# Altium project ControlBoard.PrjPcb
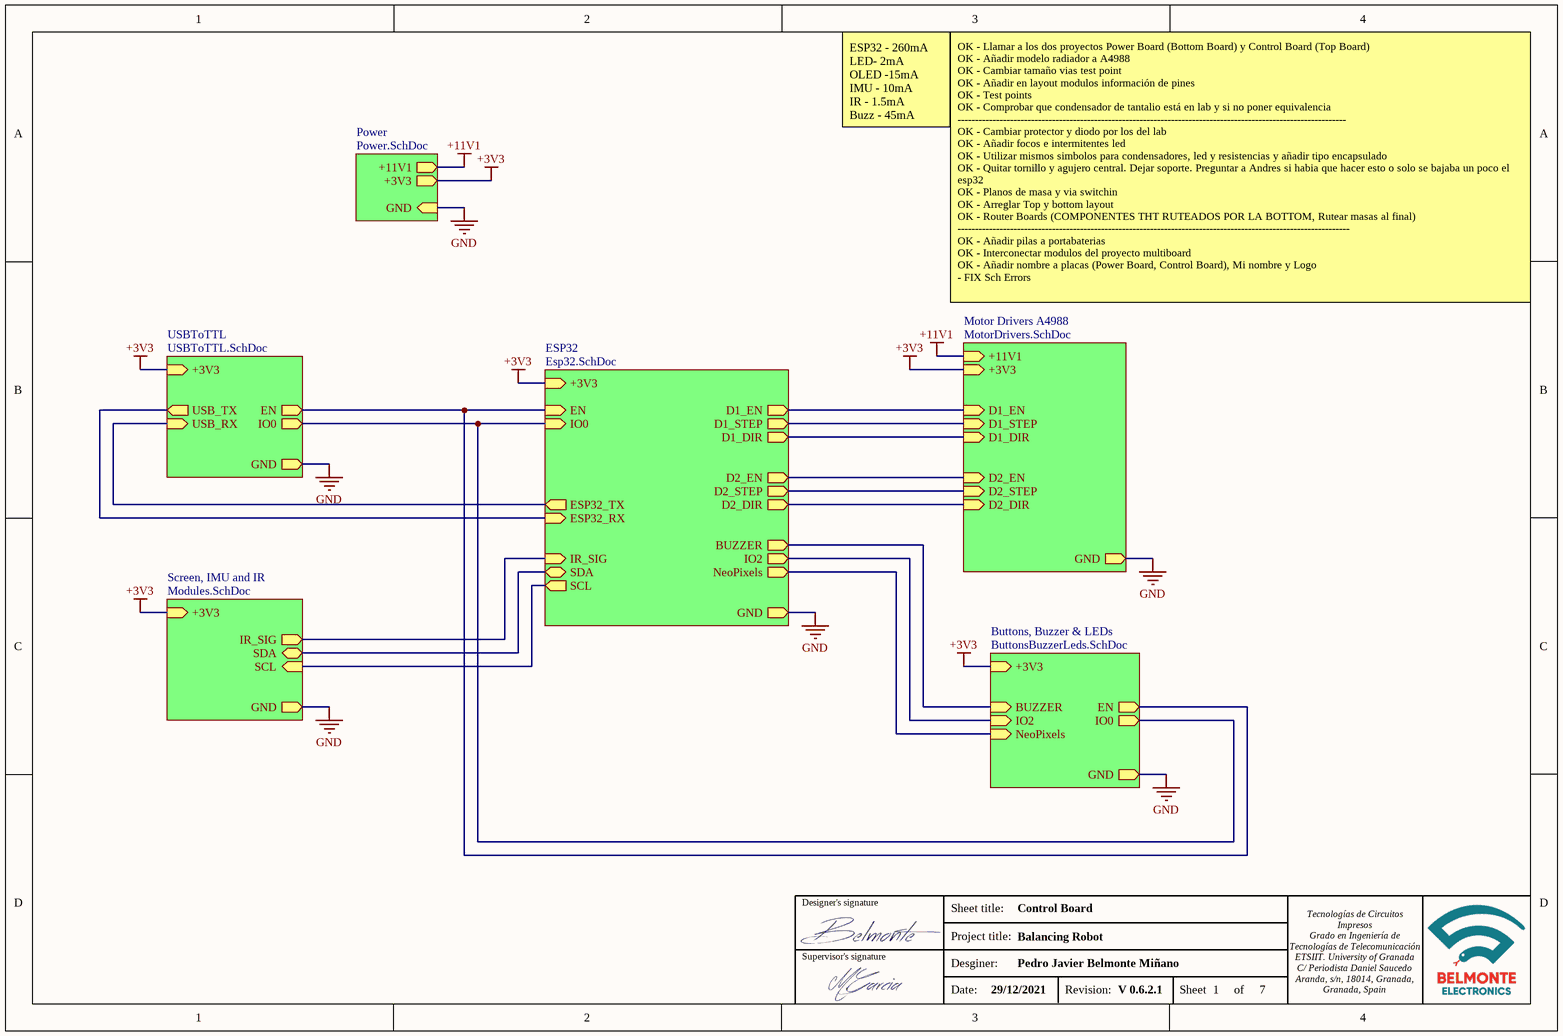
[diagram p0: ControlBoard.SchDoc]
Revision: V 0.6.2.1; ProjectTitle: Balancing Robot; Date: 29/12/2021; Author: Pedro Javier Belmonte Miñano
6 sheets, 48 parts. Net scope: hierarchical (ports join the sheet entries above them; power ports are global).
Board file: ControlBoardV6.2.PcbDoc
Sheets:
  ControlBoard.SchDoc
    ESP32 = Esp32.SchDoc
    USBToTTL = USBToTTL.SchDoc
    Motor Drivers A4988 = MotorDrivers.SchDoc
    Power = Power.SchDoc
    Buttons, Buzzer & LEDs = ButtonsBuzzerLeds.SchDoc

## Sheet ControlBoard.SchDoc: Control Board
size A4; SheetNumber: 1; SheetTotal: 7

### Sub-sheets
Buttons, Buzzer & LEDs = ButtonsBuzzerLeds.SchDoc: BUZZER (in), +3V3 (in), EN (out), IO2 (in), NeoPixels (in), IO0 (out), GND (out)
ESP32 = Esp32.SchDoc: +3V3 (in), GND (out), EN (in), D2_DIR (out), D2_EN (out), D1_STEP (out), SDA (bidir), D1_DIR (out), D1_EN (out), D2_STEP (out), IO0 (in), ESP32_RX (in), IR_SIG (in), SCL (out), ESP32_TX (out), BUZZER (out), IO2 (out), NeoPixels (out)
Motor Drivers A4988 = MotorDrivers.SchDoc: D1_EN (in), D2_EN (in), D2_STEP (in), +3V3 (in), D1_DIR (in), D2_DIR (in), GND (out), +11V1 (in), D1_STEP (in)
Power = Power.SchDoc: +11V1 (out), +3V3 (out), GND (in)
Screen, IMU and IR = Modules.SchDoc (file not in this document): GND (out), +3V3 (in), IR_SIG (out), SDA (bidir), SCL (in)
USBToTTL = USBToTTL.SchDoc: EN (out), GND (out), USB_RX (in), USB_TX (out), IO0 (out), +3V3 (in)

### Nets
+3V3: sheet ESP32/+3V3, sheet USBToTTL/+3V3, sheet Motor Drivers A4988/+3V3, sheet Power/+3V3, sheet Screen, IMU and IR/+3V3, sheet Buttons, Buzzer & LEDs/+3V3
+11V1: sheet Motor Drivers A4988/+11V1, sheet Power/+11V1
GND: sheet ESP32/GND, sheet USBToTTL/GND, sheet Motor Drivers A4988/GND, sheet Power/GND, sheet Screen, IMU and IR/GND, sheet Buttons, Buzzer & LEDs/GND
BUZZER: sheet ESP32/BUZZER, sheet Buttons, Buzzer & LEDs/BUZZER
D1_DIR: sheet ESP32/D1_DIR, sheet Motor Drivers A4988/D1_DIR
D1_EN: sheet ESP32/D1_EN, sheet Motor Drivers A4988/D1_EN
D1_STEP: sheet ESP32/D1_STEP, sheet Motor Drivers A4988/D1_STEP
D2_DIR: sheet ESP32/D2_DIR, sheet Motor Drivers A4988/D2_DIR
D2_EN: sheet ESP32/D2_EN, sheet Motor Drivers A4988/D2_EN
D2_STEP: sheet ESP32/D2_STEP, sheet Motor Drivers A4988/D2_STEP
EN: sheet ESP32/EN, sheet USBToTTL/EN, sheet Buttons, Buzzer & LEDs/EN
ESP32_RX: sheet ESP32/ESP32_RX, sheet USBToTTL/USB_TX
ESP32_TX: sheet ESP32/ESP32_TX, sheet USBToTTL/USB_RX
IO0: sheet ESP32/IO0, sheet USBToTTL/IO0, sheet Buttons, Buzzer & LEDs/IO0
IO2: sheet ESP32/IO2, sheet Buttons, Buzzer & LEDs/IO2
IR_SIG: sheet ESP32/IR_SIG, sheet Screen, IMU and IR/IR_SIG
NeoPixels: sheet ESP32/NeoPixels, sheet Buttons, Buzzer & LEDs/NeoPixels
SCL: sheet ESP32/SCL, sheet Screen, IMU and IR/SCL
SDA: sheet ESP32/SDA, sheet Screen, IMU and IR/SDA

### Notes on the sheet
- ESP32 - 260mA
  LED- 2mA
  OLED -15mA
  IMU - 10mA
  IR - 1.5mA
  Buzz - 45mA
- OK - Llamar a los dos proyectos Power Board (Bottom Board) y Control Board (Top Board)
  OK - Añadir modelo radiador a A4988
  OK - Cambiar tamaño vias test point
  OK - Añadir en layout modulos información de pines
  OK - Test points
  OK - Comprobar que condensador de tantalio está en lab y si no poner equivalencia
  ---------------------------------------------------------------------------------------------------------------
  OK - Cambiar protector y diodo por los del lab
  OK - Añadir focos e intermitentes led
  OK - Utilizar mismos simbolos para condensadores, led y resistencias y añadir tipo encapsulado
  OK - Quitar tornillo y agujero central. Dejar soporte. Preguntar a Andres si habia que hacer esto o solo se bajaba un poco el esp32
  OK - Planos de masa y via switchin
  OK - Arreglar Top y bottom layout
  OK - Router Boards (COMPONENTES THT RUTEADOS POR LA BOTTOM, Rutear masas al final)
  ----------------------------------------------------------------------------------------------------------------
  OK - Añadir pilas a portabaterias
  OK - Interconectar modulos del proyecto multiboard
  OK - Añadir nombre a placas (Power Board, Control Board), Mi nombre y Logo
  - FIX Sch Errors
- Designer's signature
- Sheet title:
- Supervisor's signature
- Project title:
- Desginer:
- Date:
- Revision:
- Sheet
- of
- Tecnologías de Circuitos Impresos
  Grado en Ingeniería de Tecnologías de Telecomunicación
  ETSIIT. University of Granada
  C/ Periodista Daniel Saucedo Aranda, s/n, 18014, Granada, Granada, Spain

## Sheet Esp32.SchDoc: ESP 32
size A4; SheetNumber: 2; SheetTotal: 7
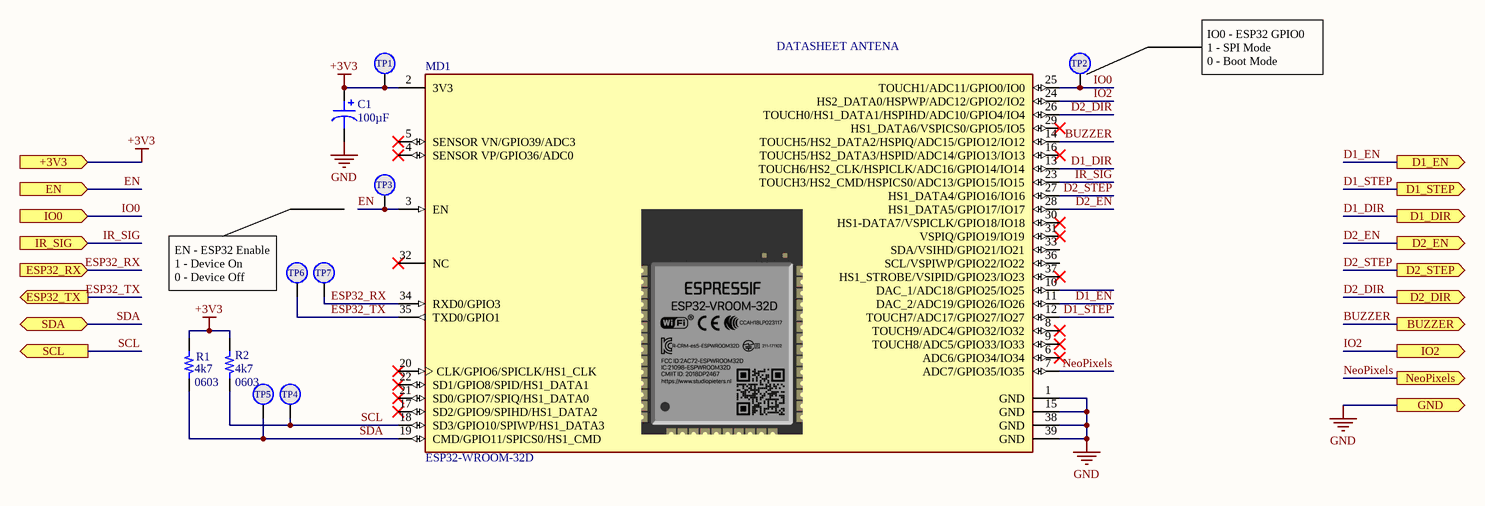
[diagram p1: Esp32.SchDoc]

### Parts
C1  Capacitance: 100µF  [CAP ALSMD POLY 5.3MM H6.1MM]  (hidden comment: ALUM 100uF)
MD1  ESP32-WROOM-32D  [FP-ESP32-WROOM-32D-MFG]
R1  4k7  Size: 0603  [RESC1608X55X30NL15T15]
R2  4k7  Size: 0603  [RESC1608X55X30NL15T15]
TP1  Test point  [TestPoint]  (value not drawn)  (no BOM)
TP2  Test point  [TestPoint]  (value not drawn)  (no BOM)
TP3  Test point  [TestPoint]  (value not drawn)  (no BOM)
TP4  Test point  [TestPoint]  (value not drawn)  (no BOM)
TP5  Test point  [TestPoint]  (value not drawn)  (no BOM)
TP6  Test point  [TestPoint]  (value not drawn)  (no BOM)
TP7  Test point  [TestPoint]  (value not drawn)  (no BOM)

### Ports
+3V3 (in), BUZZER (out), D1_DIR (out), D1_EN (out), D1_STEP (out), D2_DIR (out), D2_EN (out), D2_STEP (out), EN (in), ESP32_RX (in), ESP32_TX (out), GND (out), IO0 (in), IO2 (out), IR_SIG (in), NeoPixels (out), SCL (out), SDA (bidir)

### Nets
+3V3: C1.1 MD1.2(3V3) R1.1 R2.1 TP1.1 ; port +3V3
GND: C1.2 MD1.1(GND) MD1.15(GND) MD1.38(GND) MD1.39(GND) ; port GND
BUZZER: MD1.14(TOUCH5/HS2_DATA2/HSPIQ/ADC15/GPIO12/IO12) ; port BUZZER
D1_DIR: MD1.13(TOUCH6/HS2_CLK/HSPICLK/ADC16/GPIO14/IO14) ; port D1_DIR
D1_EN: MD1.11(DAC_2/ADC19/GPIO26/IO26) ; port D1_EN
D1_STEP: MD1.12(TOUCH7/ADC17/GPIO27/IO27) ; port D1_STEP
D2_DIR: MD1.26(TOUCH0/HS1_DATA1/HSPIHD/ADC10/GPIO4/IO4) ; port D2_DIR
D2_EN: MD1.28(HS1_DATA5/GPIO17/IO17) ; port D2_EN
D2_STEP: MD1.27(HS1_DATA4/GPIO16/IO16) ; port D2_STEP
EN: MD1.3(EN) TP3.1 ; port EN
ESP32_RX: MD1.34(RXD0/GPIO3) TP7.1 ; port ESP32_RX
ESP32_TX: MD1.35(TXD0/GPIO1) TP6.1 ; port ESP32_TX
IO0: MD1.25(TOUCH1/ADC11/GPIO0/IO0) TP2.1 ; port IO0
IO2: MD1.24(HS2_DATA0/HSPWP/ADC12/GPIO2/IO2) ; port IO2
IR_SIG: MD1.23(TOUCH3/HS2_CMD/HSPICS0/ADC13/GPIO15/IO15) ; port IR_SIG
NeoPixels: MD1.7(ADC7/GPIO35/IO35) ; port NeoPixels
SCL: MD1.18(SD3/GPIO10/SPIWP/HS1_DATA3) R2.2 TP4.1 ; port SCL
SDA: MD1.19(CMD/GPIO11/SPICS0/HS1_CMD) R1.2 TP5.1 ; port SDA

Not connected (* = marked no-connect by the designer): MD1 4(SENSOR_VP/GPIO36/ADC0)* 5(SENSOR_VN/GPIO39/ADC3)* 6(ADC6/GPIO34/IO34)* 8(TOUCH9/ADC4/GPIO32/IO32)* 9(TOUCH8/ADC5/GPIO33/IO33)* 10(DAC_1/ADC18/GPIO25/IO25) 16(TOUCH5/HS2_DATA3/HSPID/ADC14/GPIO13/IO13)* 17(SD2/GPIO9/SPIHD/HS1_DATA2)* 20(CLK/GPIO6/SPICLK/HS1_CLK)* 21(SD0/GPIO7/SPIQ/HS1_DATA0)* 22(SD1/GPIO8/SPID/HS1_DATA1)* 29(HS1_DATA6/VSPICS0/GPIO5/IO5)* 30(HS1-DATA7/VSPICLK/GPIO18/IO18)* 31(VSPIQ/GPIO19/IO19)* 32(NC)* 33(SDA/VSIHD/GPIO21/IO21) 36(SCL/VSPIWP/GPIO22/IO22) 37(HS1_STROBE/VSIPID/GPIO23/IO23)*

### Notes on the sheet
- (near MD1) DATASHEET ANTENA
- IO0 - ESP32 GPIO0
  1 - SPI Mode
  0 - Boot Mode
- (near TP6) EN - ESP32 Enable
  1 - Device On
  0 - Device Off
- Designer's signature
- Sheet title:
- Supervisor's signature
- Project title:
- Desginer:
- Date:
- Revision:
- Sheet
- of
- Tecnologías de Circuitos Impresos
  Grado en Ingeniería de Tecnologías de Telecomunicación
  ETSIIT. University of Granada
  C/ Periodista Daniel Saucedo Aranda, s/n, 18014, Granada, Granada, Spain

### Library data of the parts
C1 = MAL218497352E3: CAP ALUM 100UF 4V 2000H; Manufacturer: Vishay Beyschlag/Draloric/BC Components; ESR (Equivalent Series Resistance): 25mOhm; Lifetime @ Temp.: 2000 Hrs @ 105°C; Ripple Current @ High Frequency: 2.31A @ 100kHz; Ripple Current @ Low Frequency: 115.5mA @ 120Hz; Surface Mount Land Size: 0.209" L x 0.209" W (5.30mm x 5.30mm); Tolerance: ±20%; Type: Polymer; Value: 100µF; Part Number: MAL218497352E3; Applications: General Purpose; ComponentLink2Description: DigiKey Link; ComponentLink2URL: http://digikey.com/product-detail/en/vishay-beyschlag-draloric-bc-components/MAL218497352E3/56-MAL218497352E3-ND/12814066; Device Package: Radial, Can - SMD; Height - Seated (Max): 0.240" (6.10mm); LastUpdated: 08/30/2020 21:02:23; Lifecycle Status: Active; Minimum Order: 5000; Mounting Type: Surface Mount; Packaging: Box; PartId: 2781; Price: 0.27; Series: 184 CPNS; Size / Dimension: 0.197" Dia (5.00mm); Supplier 1: DigiKey; Supplier Part Number 1: 56-MAL218497352E3-ND
MD1 = CMP-194065-000003-1: WIFI MODULE 32MBITS SPI FLASH; Manufacturer: Espressif Systems; Max Supply Voltage: 3.6V; Nominal Supply Current: 500mA; Max Frequency: 2484MHz; Number Of Adc Channels: 16; Number Of Gpio: 32; Interface: I2C,SPI,UART,Ethernet,I2S,Other; Data Rate: 150Mbits/s; Min Supply Voltage: 3V; Bandwidth: 72MHz; Sensitivity: -98dBm; Octopart: https://octopart.com/esp32-wroom-32d-espressif+systems-91040050; Package: ESP32-WROOM-32D; ComponentLink2URL: https://www.espressif.com/sites/default/files/documentation/esp32-wroom-32d_esp32-wroom-32u_datasheet_en.pdf; Lead Free: Yes; Category: UNK; Mouser Description: Wi-Fi/BT BLE Module ESP32-D0WD, SPI Flash, UART, P; Device Class L1: Integrated Circuits (ICs); RoHS: TRUE; Temperature Range Low: -40°C; ComponentLink2Description: Datasheet; Digikey Description: WIFI MODULE 32MBITS SPI FLASH; Height: 3.2mm; Temperature: -40°C to +85°C; Manufacturer Part Number: ESP32-WROOM-32D; Device Class L3: Transceivers; Device Class L2: RF Semiconductors and Devices; Temperature Range High: +85°C; Automotive: No
R1 R2 = CMP-1012-00586-3: Precision Thick Film Chip Resistor, 4.7 KOhm, +/- 1%, -55 to 155 degC, 0603 (1608 Metric), RoHS, Tape and Reel; Manufacturer: Panasonic; Manufacturer Part Number: ERJ-3EKF4701V; Manufacturer: Vishay Dale; Manufacturer Part Number: CRCW06034K70FKTB; Manufacturer: Bourns; Manufacturer Part Number: CR0603-FX-4701ELF; Manufacturer: Yageo; Manufacturer Part Number: RC0603FR-074K7L; Manufacturer Part Number: CRCW06034K70FKTC; Manufacturer Part Number: CRCW06034K70FKEC; Manufacturer: Vishay; Manufacturer Part Number: CRCW06034K70FKEA; Manufacturer Part Number: CRCW06034K70FKTA; Manufacturer Part Number: CRCW06034K70FKEB; Voltage Rating: 50 V; Elements: 4; Case\Package: 1205; Tolerance: 5%; Power Rating: 250 mW; Max Operating Temperature: 125 degC; REACH SVHC: No SVHC; Width: 0.063 inch; Length: 0.126 inch; Mount: Surface Mount; Package Quantity: 1; DatasheetVersion: Apr-15; ComponentLink1Description: Manufacturer URL; Min Operating Temperature: -55 degC; Packaging: Tape and Reel; Radiation Hardening: No; ComponentLink2URL: http://industrial.panasonic.com/cdbs/www-data/pdf/RDA0000/AOA0000C86.pdf; Case Code (Metric): 3216; Pins: 8; Case Code (Imperial): 1206; Type (Resistor): Thick Film; RoHSCompliant: true; ComponentLink2Description: Datasheet; PackageDescription: 2-Pin Surface Mount Device, Body 1.6 x 0.85 mm; ComponentLink1URL: http://www.panasonic.com/; Height: 0.024 inch; Resistance: 4k7
TP1-TP7 = TestPoint

## Sheet USBToTTL.SchDoc: USB To TTL
size A4; SheetNumber: 3; SheetTotal: 7
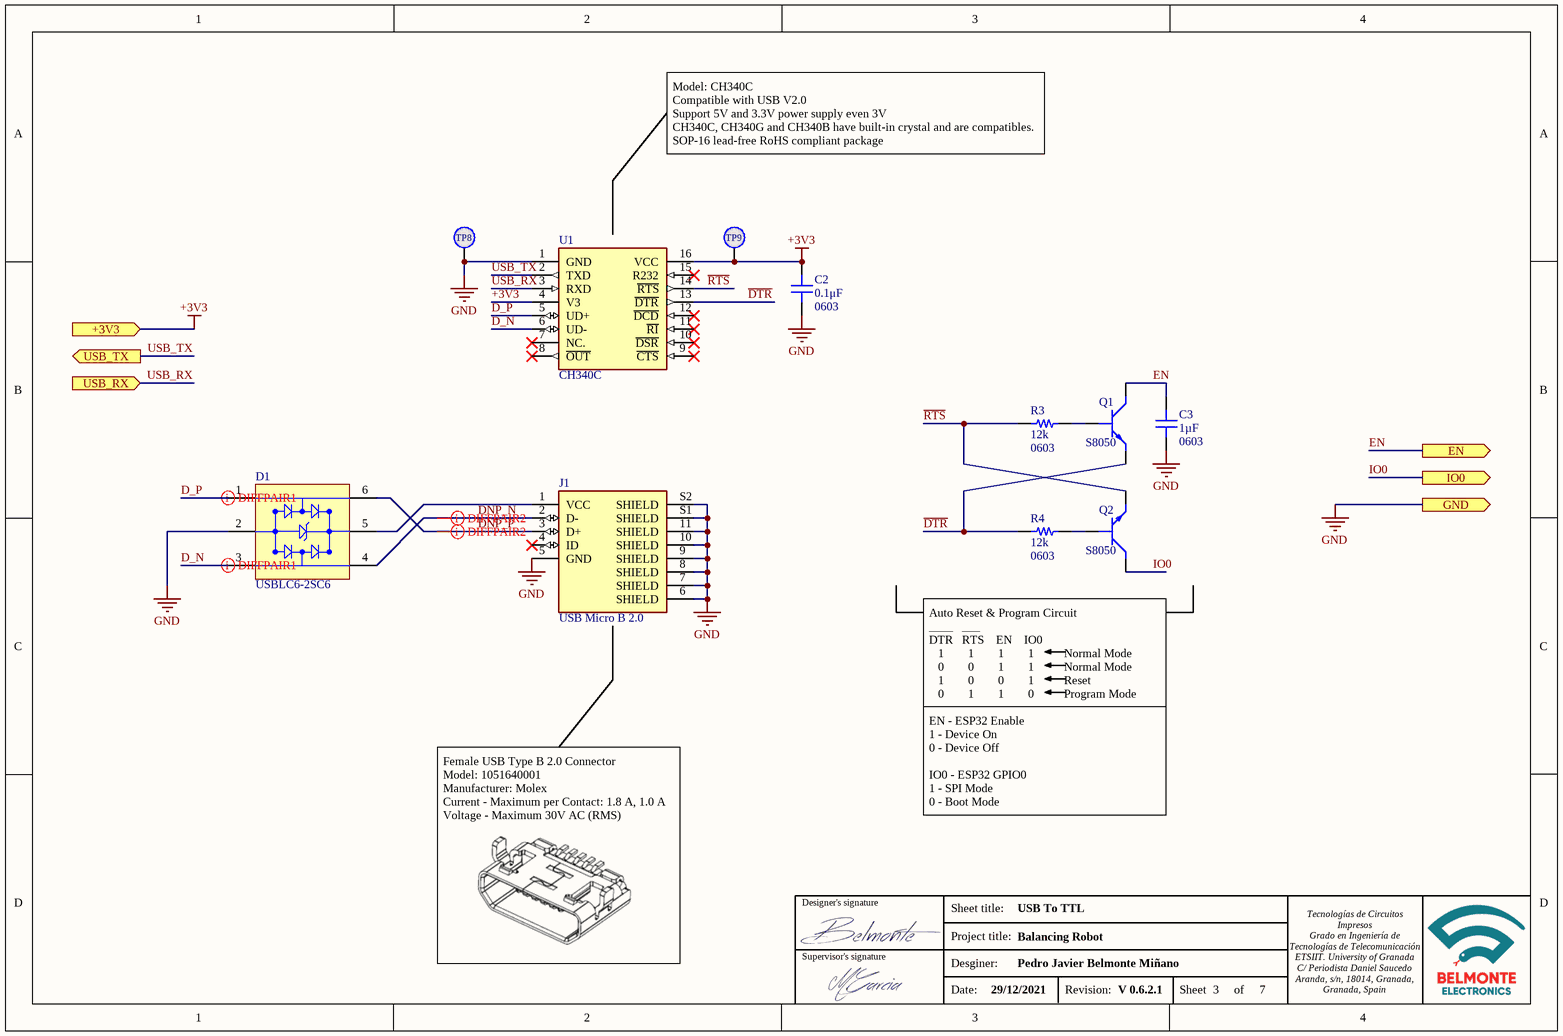
[diagram p2: USBToTTL.SchDoc]

### Parts
C2  0.1μF  Package: 0603  [FP-C0603C-CF-MFG]
C3  1µF  Size: 0603  [CAP 0603_1608]
D1  USBLC6-2SC6  [STM-SOT23-6L_V]
J1  USB Micro B 2.0  [AMPHENOL_10103594-0001LF]
Q1  S8050  [SOT95P240X115-3N]
Q2  S8050  [SOT95P240X115-3N]
R3  12k  Size: 0603  [RES 0603_1608]
R4  12k  Size: 0603  [RES 0603_1608]
TP8  Test point  [TestPoint]  (value not drawn)  (no BOM)
TP9  Test point  [TestPoint]  (value not drawn)  (no BOM)
U1  CH340C  [SOIC127P600X180-16N]

### Ports
+3V3 (in), EN (out), GND (out), IO0 (out), USB_RX (in), USB_TX (out)

### Nets
+3V3: C2.2 TP9.1 U1.4(V3) U1.16(VCC) ; port +3V3
GND: C2.1 C3.2 D1.2(GND) J1.5(GND) J1.6(SHIELD) J1.7(SHIELD) J1.8(SHIELD) J1.9(SHIELD) J1.10(SHIELD) J1.11(SHIELD) J1.S1(SHIELD) J1.S2(SHIELD) TP8.1 U1.1(GND) ; port GND
~{DTR}: Q1.3(E) R4.1 U1.13(~{DTR})
D_N: D1.3(I/O_2) U1.6(UD-)
D_P: D1.1(I/O_1) U1.5(UD+)
DNP_N: D1.4(I/O_3) J1.2(D-)
DNP_P: D1.6(I/O_4) J1.3(D+)
EN: C3.1 Q1.2(C) ; port EN
IO0: Q2.2(C) ; port IO0
~{RTS}: Q2.3(E) R3.1 U1.14(~{RTS})
USB_RX: U1.3(RXD) ; port USB_RX  [project net ESP32_TX]
USB_TX: U1.2(TXD) ; port USB_TX  [project net ESP32_RX]
NetD1_5: D1.5(VBUS) J1.1(VCC)
NetQ1_1: Q1.1(B) R3.2
NetQ2_1: Q2.1(B) R4.2

Not connected (* = marked no-connect by the designer): J1 4(ID)*; U1 7(NC.)* 8(~{OUT})* 9(~{CTS})* 10(~{DSR})* 11(~{RI})* 12(~{DCD})* 15(R232)*

### Layout directives
differential pair: D_N, D_P, DNP_N, DNP_P

### Notes on the sheet
- Model: CH340C
  Compatible with USB V2.0
  Support 5V and 3.3V power supply even 3V
  CH340C, CH340G and CH340B have built-in crystal and are compatibles.
  SOP-16 lead-free RoHS compliant package
- (near Q2) Auto Reset & Program Circuit
  ____   ___
  DTR   RTS    EN    IO0
  1        1        1        1	         Normal Mode
  0        0        1        1          Normal Mode
  1        0        0        1          Reset
  0        1        1        0          Program Mode
- EN - ESP32 Enable
  1 - Device On
  0 - Device Off
  IO0 - ESP32 GPIO0
  1 - SPI Mode
  0 - Boot Mode
- Female USB Type B 2.0 Connector
  Model: 1051640001
  Manufacturer: Molex
  Current - Maximum per Contact: 1.8 A, 1.0 A
  Voltage - Maximum 30V AC (RMS)
- Designer's signature
- Sheet title:
- Supervisor's signature
- Project title:
- Desginer:
- Date:
- Revision:
- Sheet
- of
- Tecnologías de Circuitos Impresos
  Grado en Ingeniería de Tecnologías de Telecomunicación
  ETSIIT. University of Granada
  C/ Periodista Daniel Saucedo Aranda, s/n, 18014, Granada, Granada, Spain

### Library data of the parts
C2 = CMP-2006-03061-2: CAP CER 0.1UF 50V X7R 0603; Manufacturer: KEMET; Manufacturer Part Number: C0603C104K5RACTU; Tolerance: 0.1; Temperature Coefficient: 30ppm/°C; Material: Ceramic; Automotive Grade: Grade 1; Capacitance: 0.10 μF; Temperature: -55°C to +125°C; RoHS: TRUE; Temperature Range High: +125°C; Lead Free: Yes; Octopart: https://octopart.com/c0603c104k5ractu-kemet-139244; Digikey Description: CAP CER 0.1UF 50V X7R 0603; Category: Cap; ComponentLink2Description: Datasheet; Temperature Range Low: -55°C; Device Class L1: Passive Components; Voltage Rating: 50 V; Automotive: Yes; Device Class L3: Ceramic Capacitors; ComponentLink2URL: https://api.kemet.com/component-edge/download/datasheet/C0603C100J5GACAUTO.pdf; Device Class L2: Capacitors; Temperature Characteristic: X7R; Height: 0.87mm
C3 = C0603C105K4RACAUTO: CAP CER 0603 1UF 16V X7R 10%; Manufacturer: KEMET; Part Number: C0603C105K4RACAUTO; Applications: Automotive, Bypass, Decoupling; Capacitance: 1µF; ComponentLink1Description: Datasheet; ComponentLink1URL: https://api.kemet.com/component-edge/download/datasheet/C0603C105K4RACAUTO.pdf; ComponentLink2Description: DigiKey Link; ComponentLink2URL: http://digikey.com/product-detail/en/kemet/C0603C105K4RACAUTO/399-17704-1-ND/8635855; Device Package: 0603 (1608 Metric); LastUpdated: 09/02/2020 01:03:36; Lifecycle Status: Active; Minimum Order: 1; Mounting Type: Surface Mount, MLCC; Operating Temperature: -55°C ~ 125°C; Package / Case: 0603 (1608 Metric); Packaging: TapeAndReel; PartId: 2179; Part Status: Active; Price: 0.02; Ratings: AEC-Q200; Series: SMD Auto X7R; Size / Dimension: 0.063" L x 0.031" W (1.60mm x 0.80mm); Supplier 1: DigiKey; Supplier Part Number 1: 399-17704-1-ND; Temperature Coefficient: X7R; Thickness (Max): 0.037" (0.95mm); Tolerance: ±10%; Voltage - Rated: 16V; Value: 1µF
D1 = CMP-2000-05378-1: Very low capacitance ESD protection, 3.5 pF, -40 to 125 degC, 6-Pin SOT23, RoHS, Tape and Reel; Manufacturer: STMicroelectronics; Polarity: Uni-Directional; Clamping Voltage: 17V; Rad Hardened: No; Product Height (mm): 1.3mm; Leakage Current (Max): 0.15uA; Product Length (mm): 3.05mm; Number of Elements: 1; Peak Pulse Current: 5A; Configuration: Dual; Reverse Breakdown Voltage: 6V; Working Voltage (Max): 5V; Capacitance Value: 3.5pF; Suppressor Type: DiodeArrays; Product Depth (mm): 1.75mm; Test Current (It): 1mA; Package / Case: SOT-23; Operating Temperature Max Deg. C: 125C; Package Description: 6-Pin Small Outline Transistor, Body 2.925 x 1.625 mm, Pitch 0.95 mm; Package Reference: SOT23-6L; Datasheet Version: Rev. 5, 10/2011; Operating Temperature Min Deg. C: -40C; Mounting Style: SurfaceMount; Direction Type: Uni-Directional; Mounting: SurfaceMount; Pin Count: 6; Leakage Current: 0.15uA; Packaging: TapeandReel; Operating Temperature Classification: Automotive; Clamping Voltage (Max): 17V; Manufacturer URL: http://www.st.com/; Reverse Stand-off Voltage: 5V; Datasheet URL: http://www.st.com/st-web-ui/static/active/en/resource/technical/document/datasheet/CD00050750.pdf; Working Voltage: 5V; Operating Temp Range: -40Cto125C; Manufacturer Part Number: USBLC6-2SC6
J1 = 10103594-0001LF: USB - micro B USB 2.0 Receptacle Connector 5 Position Surface Mount, Right Angle; Through Hole; MF: Amphenol ICC (FCI); Package: None; MP: 10103594-0001LF; Check_prices: https://www.snapeda.com/parts/10103594-0001LF/Amphenol%20FCI/view-part/5161044/?ref=eda; Purchase-URL: https://pricing.snapeda.com/search/part/10103594-0001LF/?ref=eda; Value: *; Availability: Good; Price: None; SnapEDA_Link: https://www.snapeda.com/parts/10103594-0001LF/Amphenol%20FCI/view-part/5161044/?ref=snap
Q1 Q2 = S8050: Transistor; Manufacturer_Name: Yenji Elec; Datasheet Link: https://datasheet.lcsc.com/szlcsc/Yenji-Elec-S8050_C139514.pdf; Height: 1.15mm; Manufacturer_Part_Number: S8050
R3 R4 = RMCF0603JT12K0: RES 12K OHM 5% 1/10W 0603; Manufacturer: Stackpole Electronics Inc; Power (Watts): 0.1W, 1/10W; Resistance: 12 kOhms; Temperature Coefficient: ±200ppm/°C; Value: 12 kOhms; Part Number: RMCF0603JT12K0; ComponentLink1Description: Datasheet; ComponentLink1URL: https://www.seielect.com/catalog/sei-rmcf_rmcp.pdf; ComponentLink2Description: DigiKey Link; ComponentLink2URL: http://digikey.com/product-detail/en/stackpole-electronics-inc/RMCF0603JT12K0/RMCF0603JT12K0CT-ND/1943192; Composition: Thick Film; Device Package: 0603 (1608 Metric); Features: Automotive AEC-Q200; Height - Seated (Max): 0.022" (0.55mm); LastUpdated: 09/02/2020 01:10:24; Lifecycle Status: Active; Minimum Order: 1; Number of Terminations: 2; Operating Temperature: -55°C ~ 155°C; Package / Case: 0603 (1608 Metric); Packaging: CutTape; PartId: 5166; Part Status: Active; Price: 0.10; Ratings: AEC-Q200; Series: RMCF; Size / Dimension: 0.061" L x 0.031" W (1.55mm x 0.80mm); Supplier 1: DigiKey; Supplier Part Number 1: RMCF0603JT12K0CT-ND; Supplier Device Package: 0603; Tolerance: ±5%
TP8 TP9 = TestPoint
U1 = CH340C: USB to serial chip CH340; MF: WCH; Package: None; Availability: Not in stock; SnapEDA_Link: https://www.snapeda.com/parts/CH340C/WCH/view-part/?ref=snap; MP: CH340C; Check_prices: https://www.snapeda.com/parts/CH340C/WCH/view-part/?ref=eda; Value: *; Price: None

## Sheet MotorDrivers.SchDoc: Motor Drivers A4988
size A4; SheetNumber: 4; SheetTotal: 7
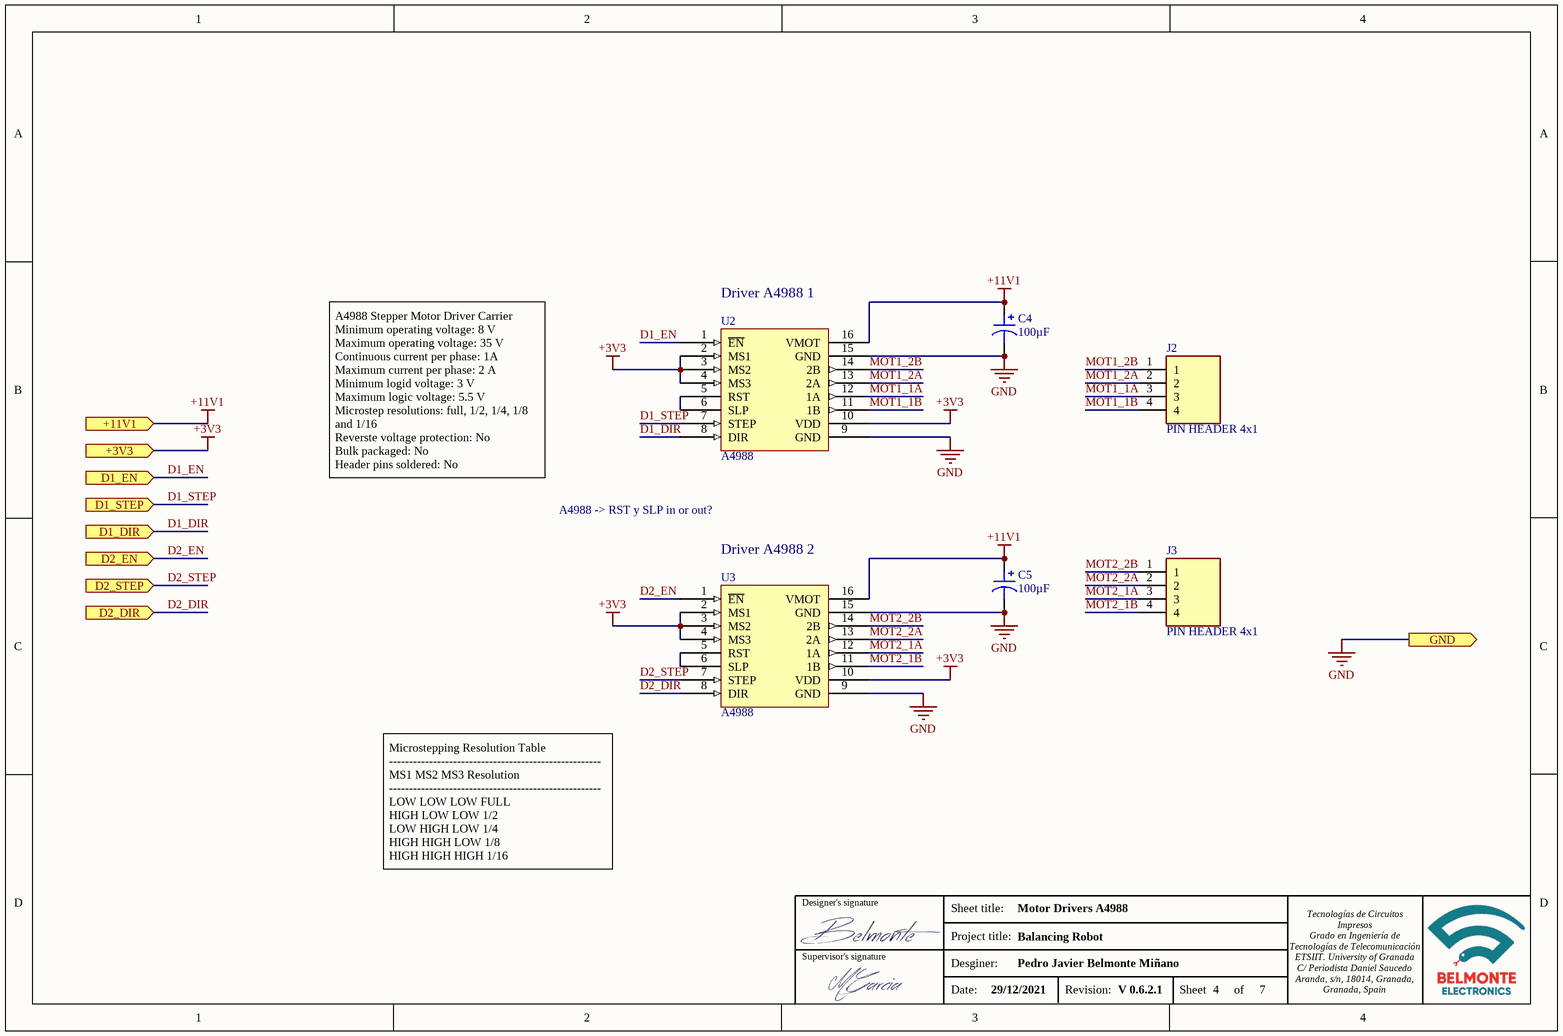
[diagram p3: MotorDrivers.SchDoc]

### Parts
C4  Capacitance: 100µF  [CAP ALSMD POLY 5.3MM H6.1MM]  (hidden comment: ALUM 100uF)
C5  Capacitance: 100µF  [CAP ALSMD POLY 5.3MM H6.1MM]  (hidden comment: ALUM 100uF)
J2  PIN HEADER 4x1  [HDRV4W50P0X200_1X4_800X200X525P]
J3  PIN HEADER 4x1  [HDRV4W50P0X200_1X4_800X200X525P]
U2  A4988  [A4988]
U3  A4988  [A4988]

### Ports
+3V3 (in), +11V1 (in), D1_DIR (in), D1_EN (in), D1_STEP (in), D2_DIR (in), D2_EN (in), D2_STEP (in), GND (out)

### Nets
+3V3: U2.2(MS1) U2.3(MS2) U2.4(MS3) U2.10(VDD) U3.2(MS1) U3.3(MS2) U3.4(MS3) U3.10(VDD) ; port +3V3
+11V1: C4.1 C5.1 U2.16(VMOT) U3.16(VMOT) ; port +11V1
GND: C4.2 C5.2 U2.9(GND) U2.15(GND) U3.9(GND) U3.15(GND) ; port GND
D1_DIR: U2.8(DIR) ; port D1_DIR
D1_EN: U2.1(~{EN}) ; port D1_EN
D1_STEP: U2.7(STEP) ; port D1_STEP
D2_DIR: U3.8(DIR) ; port D2_DIR
D2_EN: U3.1(~{EN}) ; port D2_EN
D2_STEP: U3.7(STEP) ; port D2_STEP
MOT1_1A: J2.3 U2.12(1A)
MOT1_1B: J2.4 U2.11(1B)
MOT1_2A: J2.2 U2.13(2A)
MOT1_2B: J2.1 U2.14(2B)
MOT2_1A: J3.3 U3.12(1A)
MOT2_1B: J3.4 U3.11(1B)
MOT2_2A: J3.2 U3.13(2A)
MOT2_2B: J3.1 U3.14(2B)
NetU2_5: U2.5(RST) U2.6(SLP)
NetU3_5: U3.5(RST) U3.6(SLP)

### Notes on the sheet
- (near U2) Driver A4988 1
- A4988 Stepper Motor Driver Carrier
  Minimum operating voltage: 8 V
  Maximum operating voltage: 35 V
  Continuous current per phase: 1A
  Maximum current per phase: 2 A
  Minimum logid voltage: 3 V
  Maximum logic voltage: 5.5 V
  Microstep resolutions: full, 1/2, 1/4, 1/8 and 1/16
  Reverste voltage protection: No
  Bulk packaged: No
  Header pins soldered: No
- A4988 -> RST y SLP in or out?
- (near U3) Driver A4988 2
- Microstepping Resolution Table
  -----------------------------------------------------
  MS1	MS2	MS3	Resolution
  -----------------------------------------------------
  LOW	LOW	LOW	FULL
  HIGH	LOW	LOW	1/2
  LOW	HIGH	LOW	1/4
  HIGH	HIGH	LOW	1/8
  HIGH	HIGH	HIGH	1/16
- Designer's signature
- Sheet title:
- Supervisor's signature
- Project title:
- Desginer:
- Date:
- Revision:
- Sheet
- of
- Tecnologías de Circuitos Impresos
  Grado en Ingeniería de Tecnologías de Telecomunicación
  ETSIIT. University of Granada
  C/ Periodista Daniel Saucedo Aranda, s/n, 18014, Granada, Granada, Spain

### Library data of the parts
C4 C5 = MAL218497352E3: as C1 on sheet Esp32; Part Number: MAL218497352E3; Applications: General Purpose; ComponentLink2Description: DigiKey Link; ComponentLink2URL: http://digikey.com/product-detail/en/vishay-beyschlag-draloric-bc-components/MAL218497352E3/56-MAL218497352E3-ND/12814066; Device Package: Radial, Can - SMD; Height - Seated (Max): 0.240" (6.10mm); LastUpdated: 08/30/2020 21:02:23; Lifecycle Status: Active; Minimum Order: 5000; Mounting Type: Surface Mount; Packaging: Box; PartId: 2781; Price: 0.27; Series: 184 CPNS; Size / Dimension: 0.197" Dia (5.00mm); Supplier 1: DigiKey; Supplier Part Number 1: 56-MAL218497352E3-ND
J2 J3 = M22-2510405: Connector; Manufacturer_Name: Harwin; Datasheet Link: https://cdn.harwin.com/pdfs/M22-251.pdf; Height: 5.25mm; Manufacturer_Part_Number: M22-2510405; Mouser Part Number: 855-M22-2510405; Mouser Price/Stock: https://www.mouser.co.uk/ProductDetail/Harwin/M22-2510405?qs=vF78I%252BjhbY9z7PsFZBZ5CA%3D%3D
U2 U3 = A4988: Pololu A4988 Stepper Motor Driver Carrier; ComponentLink1Description: Datasheet carrier; ComponentLink1URL: https://www.robotshop.com/media/files/pdf/datasheet-1182.pdf; ComponentLink2Description: Datasheet A4988; ComponentLink2URL: https://www.pololu.com/file/0J450/a4988_DMOS_microstepping_driver_with_translator.pdf

## Sheet Power.SchDoc: Power
size A4; SheetNumber: 5; SheetTotal: 7
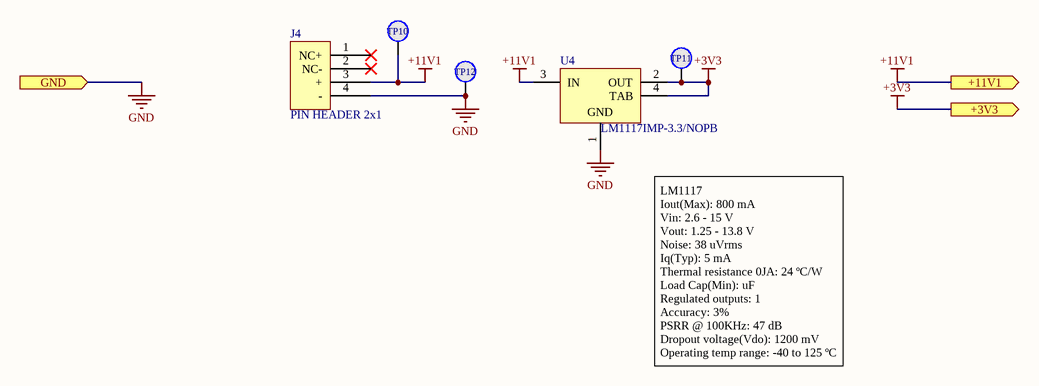
[diagram p4: Power.SchDoc]

### Parts
J4  PIN HEADER 2x1  [M20-9950245]
TP10  Test point  [TestPoint]  (value not drawn)  (no BOM)
TP11  Test point  [TestPoint]  (value not drawn)  (no BOM)
TP12  Test point  [TestPoint]  (value not drawn)  (no BOM)
U4  LM1117IMP-3.3/NOPB  [DCY0004A_N]

### Ports
+3V3 (out), +11V1 (out), GND (in)

### Nets
+3V3: TP11.1 U4.2(OUT) U4.4(TAB) ; port +3V3
+11V1: J4.3(+) TP10.1 U4.3(IN) ; port +11V1
GND: J4.4(-) TP12.1 U4.1(GND) ; port GND

Not connected (* = marked no-connect by the designer): J4 1(NC+)* 2(NC-)*

### Notes on the sheet
- LM1117
  Iout(Max): 800 mA
  Vin: 2.6 - 15 V
  Vout: 1.25 - 13.8 V
  Noise: 38 uVrms
  Iq(Typ): 5 mA
  Thermal resistance 0JA: 24 ºC/W
  Load Cap(Min): uF
  Regulated outputs: 1
  Accuracy: 3%
  PSRR @ 100KHz: 47 dB
  Dropout voltage(Vdo): 1200 mV
  Operating temp range: -40 to 125 ºC
- Designer's signature
- Sheet title:
- Supervisor's signature
- Project title:
- Desginer:
- Date:
- Revision:
- Sheet
- of
- Tecnologías de Circuitos Impresos
  Grado en Ingeniería de Tecnologías de Telecomunicación
  ETSIIT. University of Granada
  C/ Periodista Daniel Saucedo Aranda, s/n, 18014, Granada, Granada, Spain

### Library data of the parts
J4 = M20-9950245: M20-9950245 Pin Connector; ComponentLink1Description: Datasheet; ComponentLink1URL: https://www.snapeda.com/parts/M20-9950245/Harwin/datasheet/; System: Connector
TP10-TP12 = TestPoint
U4 = CMP-0062-01631-4: 800mA Low-Dropout Linear Regulator, 4-pin SOT-223, Pb-Free; Manufacturer: Texas Instruments; PackageTopMarking: XYTT*N05B; PowerWise: N; High-Reliability: Y; CompType: LDO IC; Code_IPC: SOT223-4; PackageReference: DCY0004A; PinCount: 4; PackageDescription: Molded SOT-223, 6.50 x 3.56 x 1.6mm Body, 4 Lead, 2.3mm Pitch; PartNumber: LM1117IMP-3.3/NOPB; RoHS: Y; ComponentLink1Description: Datasheet URL; Code_JEDEC: TO-261-AA; ComponentLink1URL: http://www.ti.com/general/docs/lit/getliterature.tsp?genericPartNumber=LM1117-N&fileType=pdf; Manufacturer Part Number: LM1117IMP-3.3/NOPB

## Sheet ButtonsBuzzerLeds.SchDoc: Buzzer and LEDs
size A4; SheetNumber: 7; SheetTotal: 7
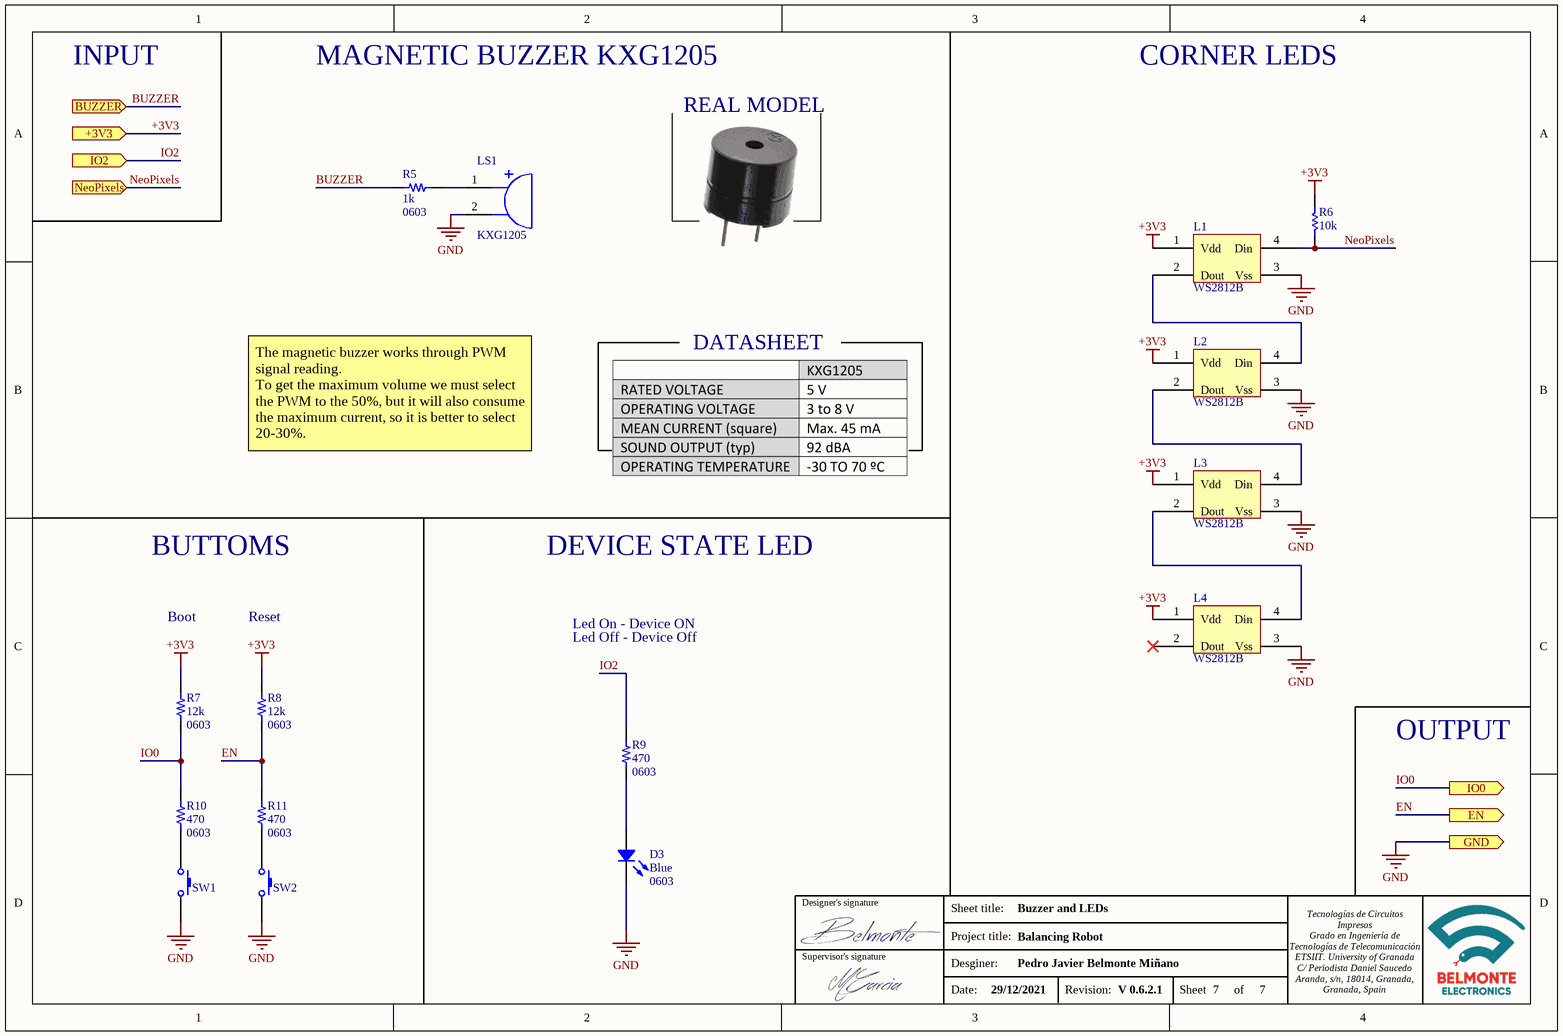
[diagram p5: ButtonsBuzzerLeds.SchDoc]

### Parts
D3  Blue  Size: 0603  [LED 0603_1608 BLUE]
L1  WS2812B  [WS2812B]
L2  WS2812B  [WS2812B]
L3  WS2812B  [WS2812B]
L4  WS2812B  [WS2812B]
LS1  KXG1205  [BUZZER]
R5  1k  Size: 0603  [RES 0603_1608]
R6  value 10k  [0805]
R7  12k  Size: 0603  [RES 0603_1608]
R8  12k  Size: 0603  [RES 0603_1608]
R9  470  Size: 0603  [RES 0603_1608]
R10  470  Size: 0603  [RES 0603_1608]
R11  470  Size: 0603  [RES 0603_1608]
SW1  FSMSMTR  [TECO-FSMSMTR_V]  (value not drawn)
SW2  FSMSMTR  [TECO-FSMSMTR_V]  (value not drawn)

### Ports
+3V3 (in), BUZZER (in), EN (out), GND (out), IO0 (out), IO2 (in), NeoPixels (in)

### Nets
+3V3: L1.1(Vdd) L2.1(Vdd) L3.1(Vdd) L4.1(Vdd) R6.1 R7.1 R8.1 ; port +3V3
GND: D3.2 L1.3(Vss) L2.3(Vss) L3.3(Vss) L4.3(Vss) LS1.2(-) SW1.2 SW2.2 ; port GND
BUZZER: R5.2 ; port BUZZER
EN: R8.2 R11.1 ; port EN
IO0: R7.2 R10.1 ; port IO0
IO2: R9.1 ; port IO2
NeoPixels: L1.4(Din) R6.2 ; port NeoPixels
NetD3_1: D3.1 R9.2
NetL1_2: L1.2(Dout) L2.4(Din)
NetL2_2: L2.2(Dout) L3.4(Din)
NetL3_2: L3.2(Dout) L4.4(Din)
NetLS1_1: LS1.1(+) R5.1
NetR10_2: R10.2 SW1.1
NetR11_2: R11.2 SW2.1

Not connected (* = marked no-connect by the designer): L4 2(Dout)*

### Notes on the sheet
- INPUT
- MAGNETIC BUZZER KXG1205
- REAL MODEL
- CORNER LEDS
- DATASHEET
- The magnetic buzzer works through PWM signal reading.
  To get the maximum volume we must select the PWM to the 50%, but it will also consume the maximum current, so it is better to select 20-30%.
- BUTTOMS
- DEVICE STATE LED
- Boot
- Reset
- Led On - Device ON
- Led Off - Device Off
- OUTPUT
- Designer's signature
- Sheet title:
- Supervisor's signature
- Project title:
- Desginer:
- Date:
- Revision:
- Sheet
- of
- Tecnologías de Circuitos Impresos
  Grado en Ingeniería de Tecnologías de Telecomunicación
  ETSIIT. University of Granada
  C/ Periodista Daniel Saucedo Aranda, s/n, 18014, Granada, Granada, Spain

### Library data of the parts
D3 = LED: LED BLUE 0603 SMD; Part Number: VLMB1300-GS08; Manufacturer: Vishay Semiconductor Opto Division; Configuration: Standard; Current - Test: 20mA; Lens Color: 1.00mm; Lens Size: 1.10mm x 0.80mm; Lens Style: Rectangle with Flat Top; Millicandela Rating: 104mcd; Viewing Angle: 130°; Voltage - Forward (Vf) (Typ): 3.3V; Wavelength - Dominant: 470nm; Wavelength - Peak: 468nm; Color: Blue; ComponentLink1Description: Datasheet; ComponentLink1URL: http://www.vishay.com/docs/82437/vlmo1300.pdf; ComponentLink2Description: DigiKey Link; ComponentLink2URL: http://digikey.com/product-detail/en/vishay-semiconductor-opto-division/VLMB1300-GS08/VLMB1300-GS08CT-ND/3025485; Device Package: 0603 (1608 Metric); Height (Max): 1.00mm; LastUpdated: 09/02/2020 01:20:26; Lifecycle Status: Active; Minimum Order: 1; Mounting Type: Surface Mount; Package / Case: 0603 (1608 Metric); Packaging: TapeAndReel; PartId: 785; Part Status: Active; Price: 0.08; Series: CHIPLED; Size / Dimension: 1.60mm L x 0.80mm W; Supplier 1: DigiKey; Supplier Part Number 1: VLMB1300-GS08CT-ND; Supplier Device Package: 0603; Value: Blue
LS1 = Buzzer
R5 = CRCW06031K00FKEAHP: RES SMD 1K OHM 1% 1/4W 0603; Manufacturer: Vishay Dale; Power (Watts): 0.25W, 1/4W; Resistance: 1 kOhms; Temperature Coefficient: ±100ppm/°C; Part Number: CRCW06031K00FKEAHP; ComponentLink1Description: Datasheet; ComponentLink1URL: http://www.vishay.com/docs/20043/crcwhpe3.pdf; ComponentLink2Description: DigiKey Link; ComponentLink2URL: http://digikey.com/product-detail/en/vishay-dale/CRCW06031K00FKEAHP/541-1.00KSCT-ND/2222766; Composition: Thick Film; Device Package: 0603 (1608 Metric); Features: Automotive AEC-Q200, Pulse Withstanding; Height - Seated (Max): 0.022" (0.55mm); LastUpdated: 09/02/2020 01:10:05; Lifecycle Status: Active; Minimum Order: 1; Number of Terminations: 2; Operating Temperature: -55°C ~ 155°C; Package / Case: 0603 (1608 Metric); Packaging: TapeAndReel; PartId: 14350; Part Status: Active; Price: 0.02; Ratings: AEC-Q200; Series: CRCW-HP; Size / Dimension: 0.063" L x 0.033" W (1.60mm x 0.85mm); Supplier 1: DigiKey; Supplier Part Number 1: 541-1.00KSCT-ND; Supplier Device Package: 0603; Tolerance: ±1%
R6 = Resistor: Supplier 1: Farnell; Supplier Part Number 1: 2358436
R7 R8 = RMCF0603JT12K0: as R3 on sheet USBToTTL; Part Number: RMCF0603JT12K0; ComponentLink1Description: Datasheet; ComponentLink1URL: https://www.seielect.com/catalog/sei-rmcf_rmcp.pdf; ComponentLink2Description: DigiKey Link; ComponentLink2URL: http://digikey.com/product-detail/en/stackpole-electronics-inc/RMCF0603JT12K0/RMCF0603JT12K0CT-ND/1943192; Composition: Thick Film; Device Package: 0603 (1608 Metric); Features: Automotive AEC-Q200; Height - Seated (Max): 0.022" (0.55mm); LastUpdated: 09/02/2020 01:10:24; Lifecycle Status: Active; Minimum Order: 1; Number of Terminations: 2; Operating Temperature: -55°C ~ 155°C; Package / Case: 0603 (1608 Metric); Packaging: CutTape; PartId: 5166; Part Status: Active; Price: 0.10; Ratings: AEC-Q200; Series: RMCF; Size / Dimension: 0.061" L x 0.031" W (1.55mm x 0.80mm); Supplier 1: DigiKey; Supplier Part Number 1: RMCF0603JT12K0CT-ND; Supplier Device Package: 0603; Tolerance: ±5%
R9-R11 = RMCF0603JT470R: RES 470 OHM 5% 1/10W 0603; Manufacturer: Stackpole Electronics Inc; Power (Watts): 0.1W, 1/10W; Resistance: 470 Ohms; Temperature Coefficient: ±200ppm/°C; Value: 470 Ohms; Part Number: RMCF0603JT470R; ComponentLink1Description: Datasheet; ComponentLink1URL: https://www.seielect.com/catalog/sei-rmcf_rmcp.pdf; ComponentLink2Description: DigiKey Link; ComponentLink2URL: http://digikey.com/product-detail/en/stackpole-electronics-inc/RMCF0603JT470R/RMCF0603JT470RCT-ND/1943166; Composition: Thick Film; Device Package: 0603 (1608 Metric); Features: Automotive AEC-Q200; Height - Seated (Max): 0.022" (0.55mm); LastUpdated: 09/02/2020 01:10:23; Lifecycle Status: Active; Minimum Order: 1; Number of Terminations: 2; Operating Temperature: -55°C ~ 155°C; Package / Case: 0603 (1608 Metric); Packaging: CutTape; PartId: 5857; Part Status: Active; Price: 0.10; Ratings: AEC-Q200; Series: RMCF; Size / Dimension: 0.061" L x 0.031" W (1.55mm x 0.80mm); Supplier 1: DigiKey; Supplier Part Number 1: RMCF0603JT470RCT-ND; Supplier Device Package: 0603; Tolerance: ±5%
SW1 SW2 = CMP-2000-07501-1: FSMSM Push Button Switch, 50 mA, -35 to 85 degC, 2-Pin SMD, RoHS, Tape and Reel; Manufacturer: TE Connectivity; Voltage Rating (DC): 24V; Electrical Life: 20000Cycles; Operating Force: 180gf; Switch Travel: 0.25mm; Contact Current Rating: 50mA; Case\/Package: SMD/SMT; Actuator Length: 1.07mm; Throw Configuration: SPST; Actuator Material: Polyamide; Contact Resistance: 100mOhm; Illumination Type: Illuminated; Max Voltage Rating (DC): 12V; Manufacturer URL: http://www.te.com/; Lead Free: LeadFree; Packaging: TapeandReel; Min Operating Temperature: -35degC; Mechanical Life: 20000Cycles; Mount: SurfaceMount; REACH SVHC: Unknown; Package Quantity: 1800; Package Reference: FSMSMTR; RoHSCompliant: true; Max Operating Temperature: 85degC; Orientation: Straight; ELV: Compliant; Datasheet URL: http://www.te.com/commerce/DocumentDelivery/DDEController?Action=showdoc&DocId=Customer+Drawing%7F1437566-3%7FC2%7Fpdf%7FEnglish%7FENG_CD_1437566-3_C2_1437566_3_1_c.dwg.pdf%7F1437566-4; Package Description: 2-Pin Surface Mount Device, Body 6 x 3.5 mm, Pitch 9.19 mm; Current Rating: 50mA; Contact Plating: Silver; Termination: GullWing; Datasheet Version: Rev. C2, 08/2014; Contact Material: Brass; Mounting Technology: SurfaceMount; Manufacturer Part Number: FSMSMTR

## Nets that join several sheets
+3V3: Esp32 (5 pins), USBToTTL (C2.2 TP9.1 U1.4 U1.16), MotorDrivers (8 pins), Power (TP11.1 U4.2 U4.4), ButtonsBuzzerLeds (7 pins)
+11V1: MotorDrivers (C4.1 C5.1 U2.16 U3.16), Power (J4.3 TP10.1 U4.3)
GND: Esp32 (5 pins), USBToTTL (14 pins), MotorDrivers (6 pins), Power (J4.4 TP12.1 U4.1), ButtonsBuzzerLeds (8 pins)
BUZZER: Esp32 (MD1.14), ButtonsBuzzerLeds (R5.2)
D1_DIR: Esp32 (MD1.13), MotorDrivers (U2.8)
D1_EN: Esp32 (MD1.11), MotorDrivers (U2.1)
D1_STEP: Esp32 (MD1.12), MotorDrivers (U2.7)
D2_DIR: Esp32 (MD1.26), MotorDrivers (U3.8)
D2_EN: Esp32 (MD1.28), MotorDrivers (U3.1)
D2_STEP: Esp32 (MD1.27), MotorDrivers (U3.7)
EN: Esp32 (MD1.3 TP3.1), USBToTTL (C3.1 Q1.2), ButtonsBuzzerLeds (R8.2 R11.1)
ESP32_RX: Esp32 (MD1.34 TP7.1), USBToTTL (U1.2)
ESP32_TX: Esp32 (MD1.35 TP6.1), USBToTTL (U1.3)
IO0: Esp32 (MD1.25 TP2.1), USBToTTL (Q2.2), ButtonsBuzzerLeds (R7.2 R10.1)
IO2: Esp32 (MD1.24), ButtonsBuzzerLeds (R9.1)
NeoPixels: Esp32 (MD1.7), ButtonsBuzzerLeds (L1.4 R6.2)